# EAGLE design untitled (EAGLE 6.5.0)
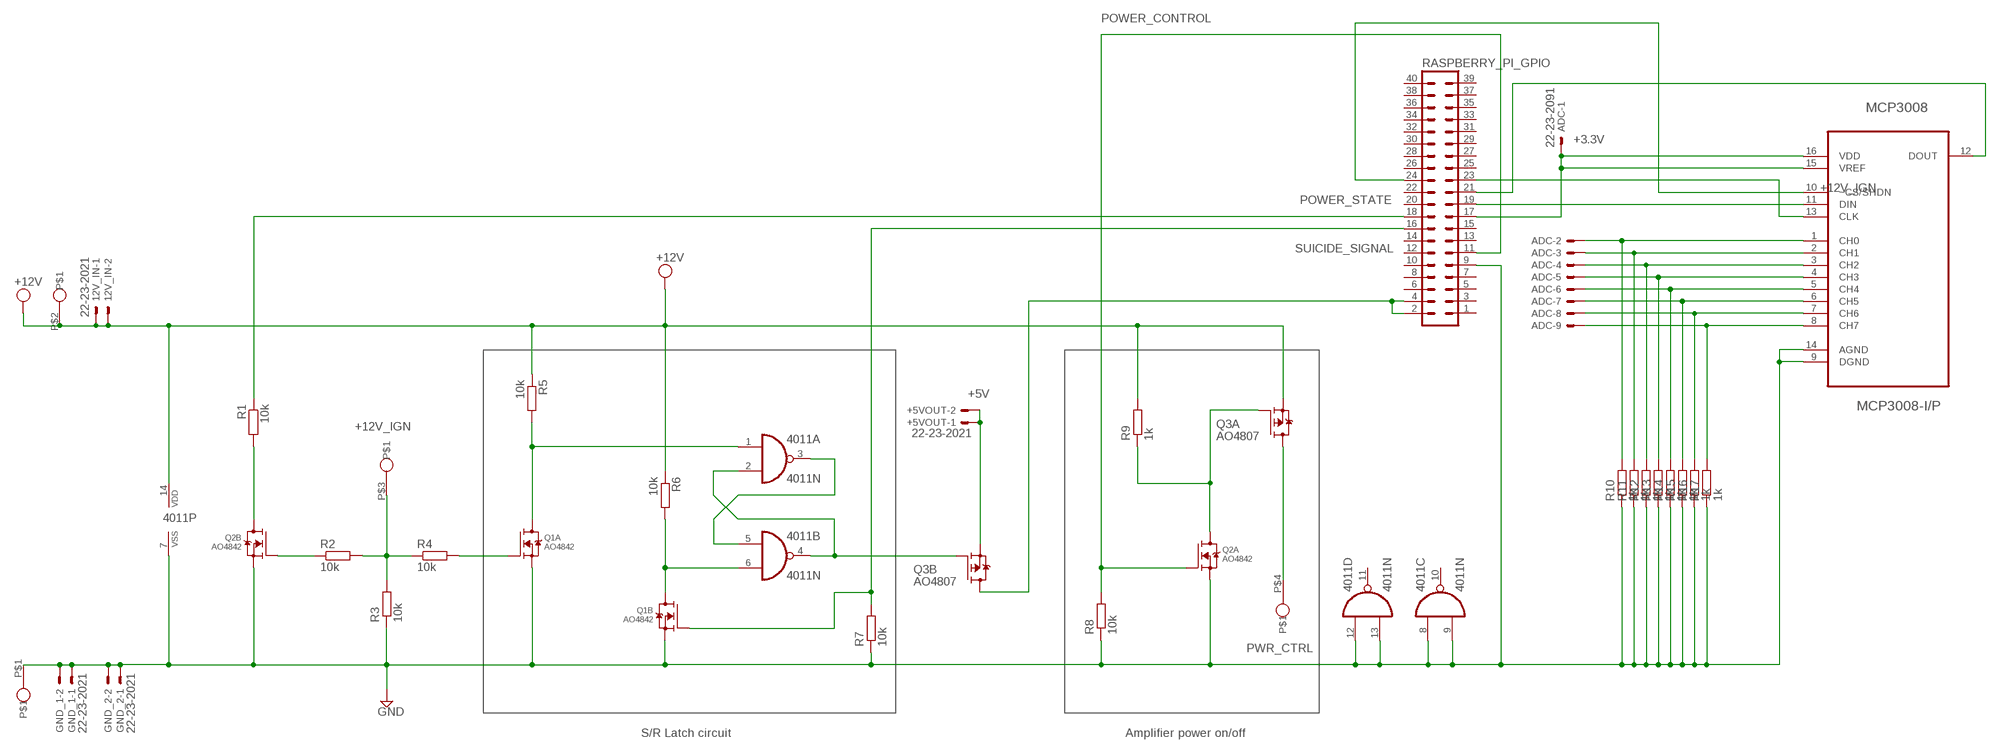
[diagram p0: schematic, sheet 1]

## Parts
12V_IN  22-23-2021  [22-23-2021]
4011  4011N  [DIL14]
+5VOUT  22-23-2021  [22-23-2021]
ADC  22-23-2091  [22-23-2091]
EXT  MKDS3  [MKDS3]
GND_1  22-23-2021  [22-23-2021]
GND_2  22-23-2021  [22-23-2021]
MCP3008  MCP3008-I/P  [DIP254P762X432-16]
Q1  AO4842  [8-SOIC]
Q2  AO4842  [8-SOIC]
Q3  AO4807  [8-SOIC]
R1  10k  R-EU_0207/10  [0207/10]
R2  10k  R-EU_0207/10  [0207/10]
R3  10k  R-EU_0207/10  [0207/10]
R4  10k  R-EU_0207/10  [0207/10]
R5  10k  R-EU_0207/10  [0207/10]
R6  10k  R-EU_0207/10  [0207/10]
R7  10k  R-EU_0207/10  [0207/10]
R8  10k  R-EU_0207/10  [0207/10]
R9  1k  R-EU_0207/10  [0207/10]
R10  1k  R-EU_0207/10  [0207/10]
R11  1k  R-EU_0207/10  [0207/10]
R12  1k  R-EU_0207/10  [0207/10]
R13  1k  R-EU_0207/10  [0207/10]
R14  1k  R-EU_0207/10  [0207/10]
R15  1k  R-EU_0207/10  [0207/10]
R16  1k  R-EU_0207/10  [0207/10]
R17  1k  R-EU_0207/10  [0207/10]
RASPBERRY_PI_GPIO  MA20-2  [MA20-2]

## Nets
+3.3V: ADC.1 MCP3008.15(VREF) MCP3008.16(VDD) RASPBERRY_PI_GPIO.17
+5V [Power]: +5VOUT.1 +5VOUT.2 Q3.P$1(B:S)
+12V_IGN [Power]: EXT.P$3 R2.2 R3.2 R4.1
ANA_0: ADC.2 MCP3008.1(CH0) R10.2
ANA_1: ADC.3 MCP3008.2(CH1) R11.2
GND@BOTTOM [Ground]: 4011.7(P:VSS) 4011.8(C:I0) 4011.9(C:I1) 4011.12(D:I0) 4011.13(D:I1) EXT.P$1 GND_1.1 GND_1.2 GND_2.1 GND_2.2 MCP3008.9(DGND) MCP3008.14(AGND) Q1.P$1(B:S) Q1.P$3(A:S) Q2.P$1(B:S) Q2.P$3(A:S) R3.1 R7.1 R8.1 R10.1 R11.1 R12.1 R13.1 R14.1 R15.1 R16.1 R17.1 RASPBERRY_PI_GPIO.9 ; supply symbol labelled GND
MOSFET_ON: 4011.2(A:I1) 4011.4(B:O) Q3.P$2(B:G)
N$1: 4011.3(A:O) 4011.5(B:I0)
N$2: 4011.6(B:I1) Q1.P$7(B:D) Q1.P$8(B:D) R6.2
N$3: MCP3008.13(CLK) RASPBERRY_PI_GPIO.23
N$4: MCP3008.12(DOUT) RASPBERRY_PI_GPIO.21
N$5: MCP3008.11(DIN) RASPBERRY_PI_GPIO.19
N$6: ADC.4 MCP3008.3(CH2) R12.2
N$7: ADC.5 MCP3008.4(CH3) R13.2
N$8: ADC.6 MCP3008.5(CH4) R14.2
N$10: ADC.7 MCP3008.6(CH5) R15.2
N$11: 4011.1(A:I0) Q1.P$5(A:D) Q1.P$6(A:D) R5.2
N$12: Q1.P$4(A:G) R4.2
N$13: MCP3008.10(~CS/SHDN) RASPBERRY_PI_GPIO.24
N$14: ADC.8 MCP3008.7(CH6) R16.2
N$15: ADC.9 MCP3008.8(CH7) R17.2
N$17: Q3.P$7(B:D) Q3.P$8(B:D) RASPBERRY_PI_GPIO.2 RASPBERRY_PI_GPIO.4
N$18: Q2.P$2(B:G) R2.1
N$21: Q2.P$7(B:D) Q2.P$8(B:D) R1.2
N$22: Q2.P$5(A:D) Q2.P$6(A:D) Q3.P$4(A:G) R9.1
POWER_CONTROL: Q2.P$4(A:G) R8.2 RASPBERRY_PI_GPIO.11
POWER_STATE: R1.1 RASPBERRY_PI_GPIO.18
PWR_CTRL: EXT.P$4 Q3.P$5(A:D) Q3.P$6(A:D)
SUICIDE_SIGNAL: Q1.P$2(B:G) R7.2 RASPBERRY_PI_GPIO.16
VCC [Power]: 12V_IN.1 12V_IN.2 4011.14(P:VDD) EXT.P$2 Q3.P$3(A:S) R5.1 R6.1 R9.2 ; supply symbol labelled +12V
Unconnected: 4011.10(C:O) 4011.11(D:O) RASPBERRY_PI_GPIO.1 RASPBERRY_PI_GPIO.3 RASPBERRY_PI_GPIO.5 RASPBERRY_PI_GPIO.6 RASPBERRY_PI_GPIO.7 RASPBERRY_PI_GPIO.8 RASPBERRY_PI_GPIO.10 RASPBERRY_PI_GPIO.12 RASPBERRY_PI_GPIO.13 RASPBERRY_PI_GPIO.14 RASPBERRY_PI_GPIO.15 RASPBERRY_PI_GPIO.20 RASPBERRY_PI_GPIO.22 RASPBERRY_PI_GPIO.25 RASPBERRY_PI_GPIO.26 RASPBERRY_PI_GPIO.27 RASPBERRY_PI_GPIO.28 RASPBERRY_PI_GPIO.29 RASPBERRY_PI_GPIO.30 RASPBERRY_PI_GPIO.31 RASPBERRY_PI_GPIO.32 RASPBERRY_PI_GPIO.33 RASPBERRY_PI_GPIO.34 RASPBERRY_PI_GPIO.35 RASPBERRY_PI_GPIO.36 RASPBERRY_PI_GPIO.37 RASPBERRY_PI_GPIO.38 RASPBERRY_PI_GPIO.39 RASPBERRY_PI_GPIO.40

## Notes on the sheet
- S/R Latch circuit | Amplifier power on/off

## Library data of the parts
12V_IN +5VOUT GND_1 GND_2 = con-molex:22-23-2021: .100" (2.54mm) Center Header - 2 Pin; MF: MOLEX; MPN: 22-23-2021; OC_FARNELL: 1462926; OC_NEWARK: 25C3832
4011 = 40xx:4011: Quad 2-input NAND
ADC = con-molex:22-23-2091: .100" (2.54mm) Center Header - 9 Pin; MF: MOLEX; MPN: 22-23-2091; OC_FARNELL: 1756827; OC_NEWARK: 56H0450
EXT = caracas:MKDS3
MCP3008 = mpc3008:MCP3008-I/P: ADC; MPN: MCP3008-I/P; OC_FARNELL: 1627174; OC_NEWARK: 19C7200; PACKAGE: DIP-16; SUPPLIER: Microchip
Q1 Q2 = caracas:AO4842: 30V Dual N-Channel MOSFET The AO4842 uses advanced trench technology to provide excellent RDS(ON) and low gate charge. The two MOSFETs make a compact and efficient switch and synchronous rectifier combination for use in buck converters.
Q3 = caracas:AO4807: 30V Dual P-Channel MOSFET The AO4807 uses advanced trench technology to provide excellent RDS(ON), and ultra-low low gate charge. This device is suitable for use as a load switch or in PWM applications.<7p>
R1-R17 = rcl:R-EU_: RESISTOR, European symbol
RASPBERRY_PI_GPIO = con-lstb:MA20-2: PIN HEADER; OC_FARNELL: unknown; OC_NEWARK: unknown

## Net classes
0 default: drill 6.35 mm, clearance 0.152 mm
1 Ground: width 0.152 mm, drill 6.35 mm, clearance 0.152 mm
2 Power: width 0.914 mm, drill 6.35 mm, clearance 0.152 mm
3 Signal: width 0.152 mm, drill 6.35 mm, clearance 0.152 mm

## Board
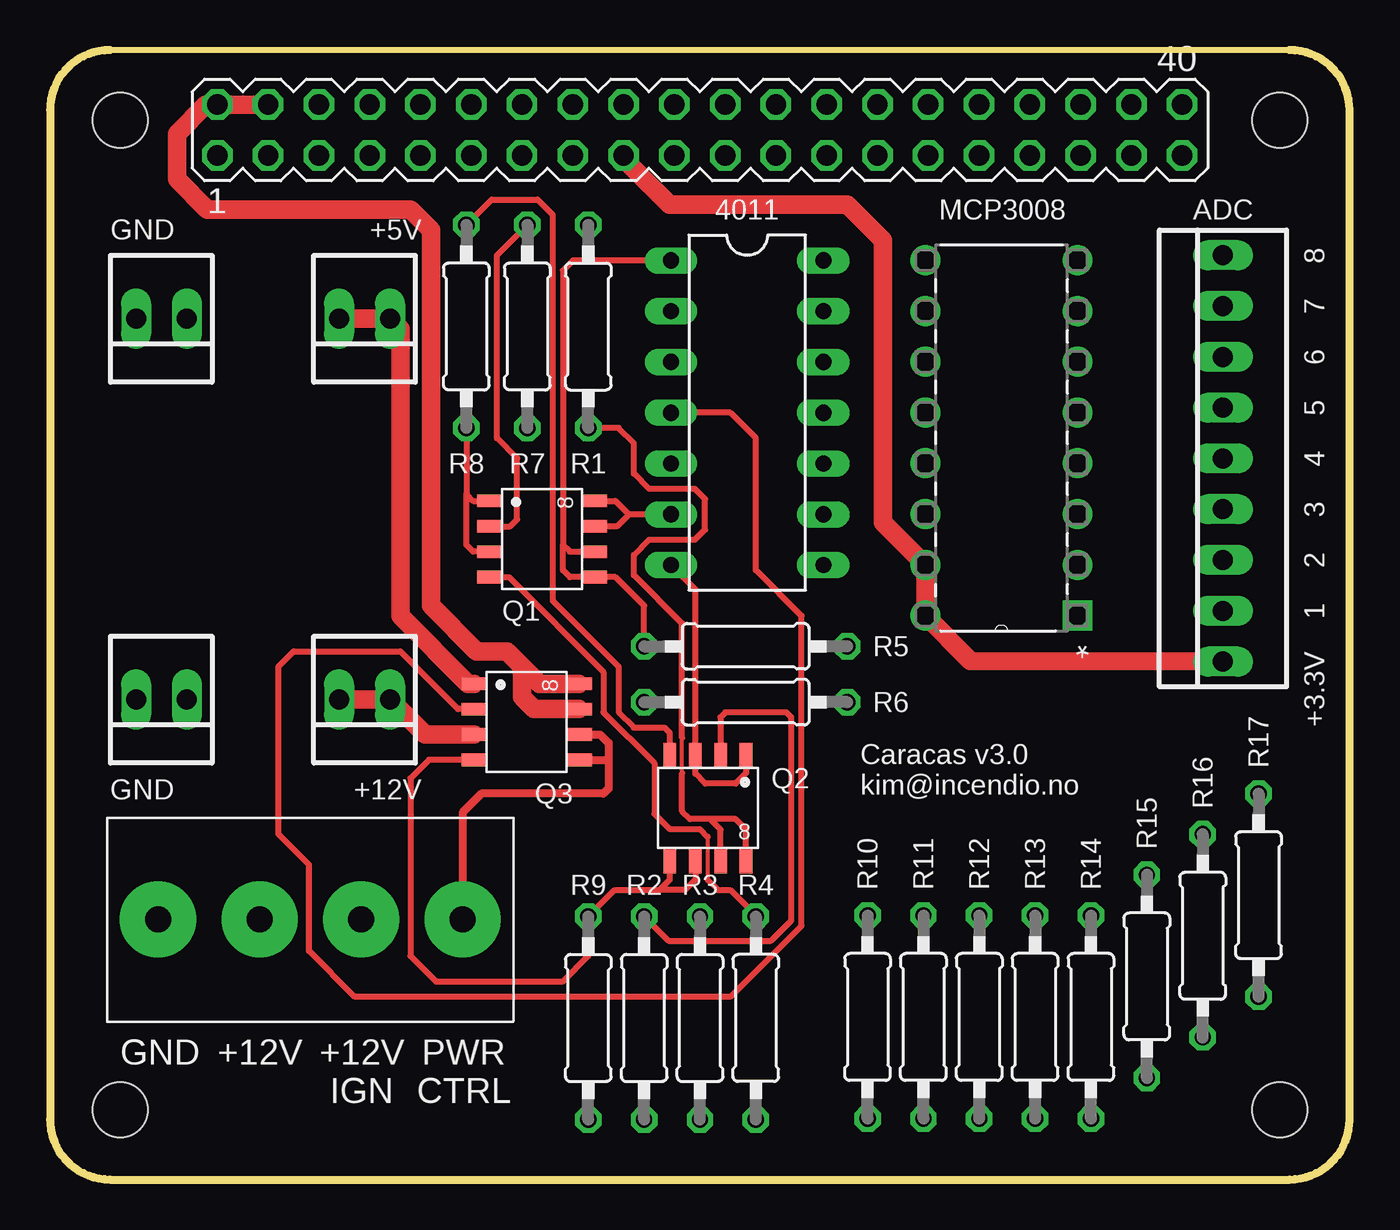
[diagram p1: board, top side]
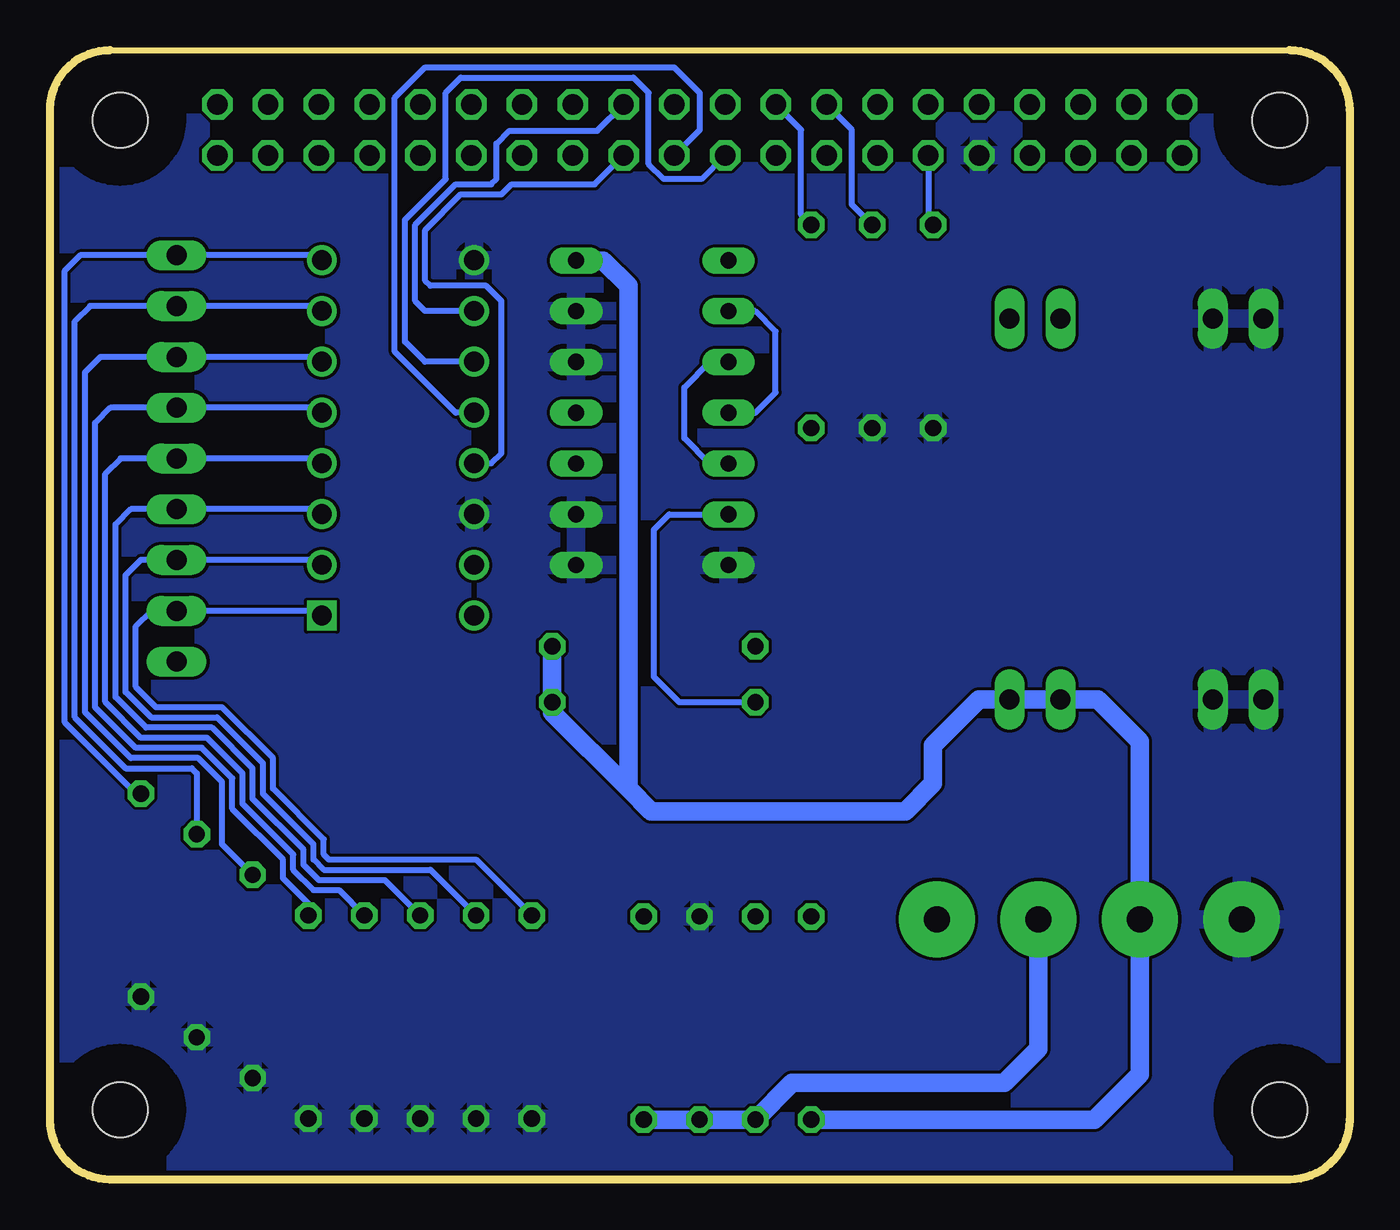
[diagram p2: board, bottom side, seen from below]

Size 65 x 56.5 mm. Coordinates in mm from the lower left corner, seen from the top.
Outline: 3,0 62,0 arc90 65,3 65,53.5 arc90 62,56.5 3,56.5 arc90 0,53.5 0,3 arc90 3,0
Copper layers (1*16): Top 0.035mm / dielectric 1.5mm / Bottom 0.035mm
Design rules "SeeedStudio_2layer_DRU_no_angle_20140221": minimum track width 6mil, minimum drill 12mil, track to track 6mil, track to pad 6mil, pad to pad 6mil, via to via 6mil, smd to smd 0mil, copper to edge 10mil, drill to drill 10mil, minimum pad ring 10mil, minimum via ring 6mil, stop-mask expansion 2mil, vias tented up to drill 100mil, thermal gap 10mil
Holes 2.75 mm at 3.5,3.5 61.5,53 3.5,53 61.5,3.5
bRestrict: 16 lines

### Footprints (pad centres in the part's own frame; a part is rotated, then mirrored left to right if it is on the bottom)
22-23-2021 = drill 1 long: 1 -1.27,0; 2 1.27,0
DIL14 = drill 0.813 long: 1 -7.62,-3.81; 2 -5.08,-3.81; 3 -2.54,-3.81; 4 0,-3.81; 5 2.54,-3.81; 6 5.08,-3.81; 7 7.62,-3.81; 8 7.62,3.81; 9 5.08,3.81; 10 2.54,3.81; 11 0,3.81; 12 -2.54,3.81; 13 -5.08,3.81; 14 -7.62,3.81
22-23-2091 = drill 1 long: 1 -10.16,0; 2 -7.62,0; 3 -5.08,0; 4 -2.54,0; 5 0,0; 6 2.54,0; 7 5.08,0; 8 7.62,0; 9 10.16,0
MKDS3 = drill 1.3 pad 3.81: P$1 -7.6,0.02; P$2 -2.52,0.02; P$3 2.56,0.02; P$4 7.64,0.02
DIP254P762X432-16 = drill 0.991 square: 1 -7.62,17.78 | drill 0.991: 2 -7.62,15.24; 3 -7.62,12.7; 4 -7.62,10.16; 5 -7.62,7.62; 6 -7.62,5.08; 7 -7.62,2.54; 8 -7.62,0; 9 0,0; 10 0,2.54; 11 0,5.08; 12 0,7.62; 13 0,10.16; 14 0,12.7; 15 0,15.24; 16 0,17.78
8-SOIC = smd 0.635 x 1.27: P$1 0.6,-0.62; P$2 1.87,-0.62; P$3 3.14,-0.62; P$4 4.41,-0.62; P$5 4.41,4.63; P$6 3.14,4.63; P$7 1.87,4.63; P$8 0.6,4.63
0207/10 = drill 0.813 octagon: 1 -5.08,0; 2 5.08,0
MA20-2 = drill 1.016 octagon: 1 -24.13,-1.27; 2 -24.13,1.27; 3 -21.59,-1.27; 4 -21.59,1.27; 5 -19.05,-1.27; 6 -19.05,1.27; 7 -16.51,-1.27; 8 -16.51,1.27; 9 -13.97,-1.27; 10 -13.97,1.27; 11 -11.43,-1.27; 12 -11.43,1.27; 13 -8.89,-1.27; 14 -8.89,1.27; 15 -6.35,-1.27; 16 -6.35,1.27; 17 -3.81,-1.27; 18 -3.81,1.27; 19 -1.27,-1.27; 20 -1.27,1.27; 21 1.27,-1.27; 22 1.27,1.27; 23 3.81,-1.27; 24 3.81,1.27; 25 6.35,-1.27; 26 6.35,1.27; 27 8.89,-1.27; 28 8.89,1.27; 29 11.43,-1.27; 30 11.43,1.27; 31 13.97,-1.27; 32 13.97,1.27; 33 16.51,-1.27; 34 16.51,1.27; 35 19.05,-1.27; 36 19.05,1.27; 37 21.59,-1.27; 38 21.59,1.27; 39 24.13,-1.27; 40 24.13,1.27

### Placement (x,y rotation side)
12V_IN  15.73,24.01 180 top
4011  34.87,38.35 270 top
+5VOUT  15.73,43.06 180 top
ADC  58.67,36.07 90 top
EXT  13,13 0 top
GND_1  5.57,43.06 180 top
GND_2  5.57,24.01 180 top
MCP3008  43.78,45.99 180 top
Q1  22.61,34.54 270 top
Q2  35.42,20.58 180 top
Q3  21.84,25.4 270 top
R1  26.92,42.67 270 top
R2  29.72,8.08 270 top
R3  32.51,8.08 270 top
R4  35.31,8.08 90 top
R5  34.8,26.67 180 top
R6  34.8,23.88 180 top
R7  23.88,42.67 90 top
R8  20.83,42.67 90 top
R9  26.92,8.08 270 top
R10  40.89,8.13 90 top
R11  43.69,8.13 90 top
R12  46.48,8.13 90 top
R13  49.28,8.13 90 top
R14  52.07,8.13 90 top
R15  54.86,10.16 90 top
R16  57.66,12.19 90 top
R17  60.45,14.22 90 top
RASPBERRY_PI_GPIO  32.5,52.5 0 top

### Tracks (layer width: path | path; a pad name or v marks a point on that pad's centre or on a via)
+3.3V
  Top 0.914: ADC.1 46.05,25.94 MCP3008.16 MCP3008.15 41.66,32.87 41.66,46.99 39.88,48.77 30.99,48.77 28.69,51.07 RASPBERRY_PI_GPIO.17
+5V
  Top 0.914: +5VOUT.2 +5VOUT.1 17.53,42.54 17.53,28.19 20.92,24.8 Q3.P$1
+12V_IGN
  Bottom 0.914: EXT.P$3 15.56,6.54 17.27,4.83 27.89,4.83 R2.2 R3.2 R4.1
ANA_0
  Bottom 0.305: R10.2 43.69,16 51.05,16 51.31,16.26 51.31,17.02 53.85,19.56 53.85,21.08 56.39,23.62 59.69,23.62 60.71,24.64 60.71,27.69 59.94,28.45 ADC.2 51.64,28.45 MCP3008.1
ANA_1
  Bottom 0.305: R11.2 45.97,15.49 51.31,15.49 51.82,16 51.82,16.76 54.36,19.3 54.36,20.83 56.64,23.11 59.94,23.11 61.21,24.38 61.21,30.23 60.45,30.99 ADC.3 51.64,30.99 MCP3008.2
GND@BOTTOM
  Top 0.305: 4011.7 32.28,29.52 Q2.P$3 32.28,20.3 32.77,19.81 34.29,19.81 34.82,20.34 Q2.P$1 | R8.1 20.83,34.29 | 20.83,34.29 21.17,33.94 Q1.P$1 | Q1.P$3 21.17,31.4 20.83,31.75 20.83,34.29
  pour Bottom: 0,0 65,0 65.1,56.4 0.1,56.4
MOSFET_ON
  Top 0.305: Q3.P$2 20.41,23.53 17.53,26.42 12.19,26.42 11.43,25.65 11.43,17.27 12.95,15.75 12.95,11.43 15.24,9.14 34.04,9.14 37.59,12.7 37.59,28.19 35.31,30.48 35.31,37.08 34.04,38.35 4011.4
  Bottom 0.305: 4011.4 29.72,38.35 28.7,39.37 28.7,42.42 29.72,43.43 4011.2
N$1
  Bottom 0.305: 4011.5 32,35.81 33.27,37.08 33.27,39.62 32,40.89 4011.3
N$2
  Top 0.305: 4011.6 28.96,33.27 | 28.96,33.27 28.36,32.67 Q1.P$7 | Q1.P$8 28.29,33.94 28.96,33.27
  Bottom 0.305: 4011.6 34.04,33.27 34.8,32.51 34.8,25.15 33.53,23.88 R6.2
N$3
  Bottom 0.305: MCP3008.13 42.91,35.83 42.42,36.32 42.42,43.94 43.18,44.7 45.97,44.7 46.23,44.96 46.23,47.5 44.45,49.28 42.42,49.28 41.91,49.78 37.76,49.78 RASPBERRY_PI_GPIO.23
N$4
  Bottom 0.305: MCP3008.12 44.69,38.37 44.7,38.35 47.75,41.4 47.75,54.1 46.23,55.63 33.78,55.63 32.51,54.36 32.51,52.49 RASPBERRY_PI_GPIO.21
N$5
  Bottom 0.305: MCP3008.11 46.24,40.91 47.24,41.91 47.24,48.01 45.21,50.04 45.21,54.36 44.45,55.12 35.81,55.12 35.05,54.36 35.05,50.8 34.29,50.04 32.42,50.04 RASPBERRY_PI_GPIO.19
N$6
  Bottom 0.305: R12.2 48.26,14.99 51.56,14.99 52.32,15.75 52.32,16.51 54.86,19.05 54.86,20.57 56.9,22.61 60.2,22.61 61.72,24.13 61.72,32.77 60.96,33.53 ADC.4 51.64,33.53 MCP3008.3
N$7
  Bottom 0.305: R13.2 50.55,14.48 51.82,14.48 52.83,15.49 52.83,16.26 55.37,18.8 55.37,20.32 57.15,22.1 60.45,22.1 62.23,23.88 62.23,35.31 61.47,36.07 ADC.5 51.64,36.07 MCP3008.4
N$8
  Bottom 0.305: R14.2 52.07,13.8 53.34,15.07 53.34,16 55.88,18.54 55.88,20.07 57.4,21.59 60.71,21.59 62.74,23.62 62.74,37.85 61.98,38.61 ADC.6 51.64,38.61 MCP3008.5
N$10
  Bottom 0.305: R15.2 56.39,16.76 56.39,19.89 57.58,21.08 60.96,21.08 63.25,23.37 63.25,40.39 62.48,41.15 ADC.7 51.64,41.15 MCP3008.6
N$11
  Top 0.305: 4011.1 26.16,45.97 25.65,45.47 25.65,31.75 | 25.65,31.75 26,31.4 Q1.P$6 | 25.65,31.75 25.65,30.48 26,30.13 Q1.P$5 28.29,30.13 29.72,28.7 R5.2
N$12
  Top 0.203: 32.89,17.14 32.89,14.99
  Top 0.305: Q1.P$4 22.95,30.13 27.69,25.4 27.69,23.37 30.23,20.83 30.23,18.29 30.99,17.53 32.51,17.53 32.89,17.14 | 32.89,14.99 33.4,14.48 34.04,14.48 35.31,13.21 R4.2
N$13
  Bottom 0.305: MCP3008.10 46.24,43.45 46.74,43.94 46.74,47.75 44.7,49.78 42.93,49.78 42.67,50.04 42.67,51.82 42.04,52.45 37.63,52.45 RASPBERRY_PI_GPIO.24
N$14
  Bottom 0.305: R16.2 57.66,20.32 57.91,20.57 61.21,20.57 63.75,23.11 63.75,42.93 62.99,43.69 ADC.8 51.64,43.69 MCP3008.7
N$15
  Bottom 0.305: R17.2 60.71,19.3 64.26,22.86 64.26,45.47 63.5,46.23 ADC.9 51.64,46.23 MCP3008.8
N$17
  Top 0.914: RASPBERRY_PI_GPIO.2 RASPBERRY_PI_GPIO.4 7.8,53.77 6.35,52.32 6.35,50.04 7.87,48.51 18.03,48.51 19.05,47.5 19.05,28.7 21.34,26.42 22.86,26.42 23.62,25.65 | Q3.P$7 24.22,23.53 23.62,24.13 23.62,25.65 | Q3.P$8 24.48,24.8 23.62,25.65
N$18
  Top 0.305: R2.1 30.94,11.94 36.07,11.94 37.08,12.95 37.08,23.11 36.83,23.37 33.78,23.37 33.53,23.11 33.53,21.21 Q2.P$2
N$21
  Top 0.203: 31.62,20.32 31.62,22.1
  Top 0.305: Q2.P$8 34.82,17.51 34.29,18.03 33.02,18.03 | 33.02,18.03 32,18.03 31.62,18.41 31.62,20.32 | Q2.P$7 33.55,17.51 33.02,18.03 | 31.62,22.1 31.62,27.81 29.21,30.23 29.21,31.24 29.97,32 32.26,32 32.77,32.51 32.77,34.04 32.26,34.54 29.97,34.54 29.21,35.31 29.21,36.83 28.45,37.59 R1.2
N$22
  Top 0.305: Q3.P$4 18.96,20.99 18.03,20.07 18.03,11.18 19.3,9.91 25.65,9.91 26.92,11.18 R9.1 28.25,14.48 30.48,14.48 | 30.48,14.48 31.01,15 Q2.P$5 | Q2.P$6 32.28,15 31.75,14.48 30.48,14.48
POWER_CONTROL
  Top 0.305: R8.2 22.1,49.02 24.38,49.02 25.15,48.26 25.15,28.96 28.45,25.65 28.45,23.37 29.21,22.61 30.73,22.61 30.99,22.35 30.99,21.21 Q2.P$4
  Bottom 0.305: RASPBERRY_PI_GPIO.11 21.07,47.99 R8.2
POWER_STATE
  Bottom 0.305: R1.1 27.43,48.26 27.43,52.51 RASPBERRY_PI_GPIO.18
PWR_CTRL
  Top 0.406: Q3.P$6 27.52,22.26 27.94,21.84 27.94,21.08 | 27.94,21.08 27.94,19.56 27.69,19.3 21.59,19.3 20.64,18.35 EXT.P$4 | Q3.P$5 27.85,20.99 27.94,21.08
SUICIDE_SIGNAL
  Top 0.305: Q1.P$2 23.02,32.67 23.37,33.02 23.37,36.07 22.35,37.08 22.35,46.23 R7.2
  Bottom 0.305: R7.2 24.89,48.77 24.89,52.51 RASPBERRY_PI_GPIO.16
VCC
  Top 0.914: 12V_IN.2 12V_IN.1 18.75,22.26 Q3.P$3
  Bottom 0.914: R9.2 12.75,3 10.48,5.27 EXT.P$2 10.48,21.91 12.58,24.01 12V_IN.2 18.54,24 20.83,21.72 20.83,19.81 22.22,18.42 34.93,18.42 36.07,19.56 | 36.07,19.56 36.07,44.7 37.34,45.97 4011.14 | 36.07,19.56 39.88,23.37 R6.1 R5.1

### Text on the board
tNames: GND | +5V | 8 | 7 | 6 | 5 | 4 | 3 | 2 | 1 | +3.3V | Caracas v3.0 / kim@incendio.no | GND | +12V | GND | +12V | +12V / IGN | PWR / CTRL